# Altium schematic sheet stm32f103core.SchDoc: STM32F103C8T6最小系统
size A4; Revision: 1.0
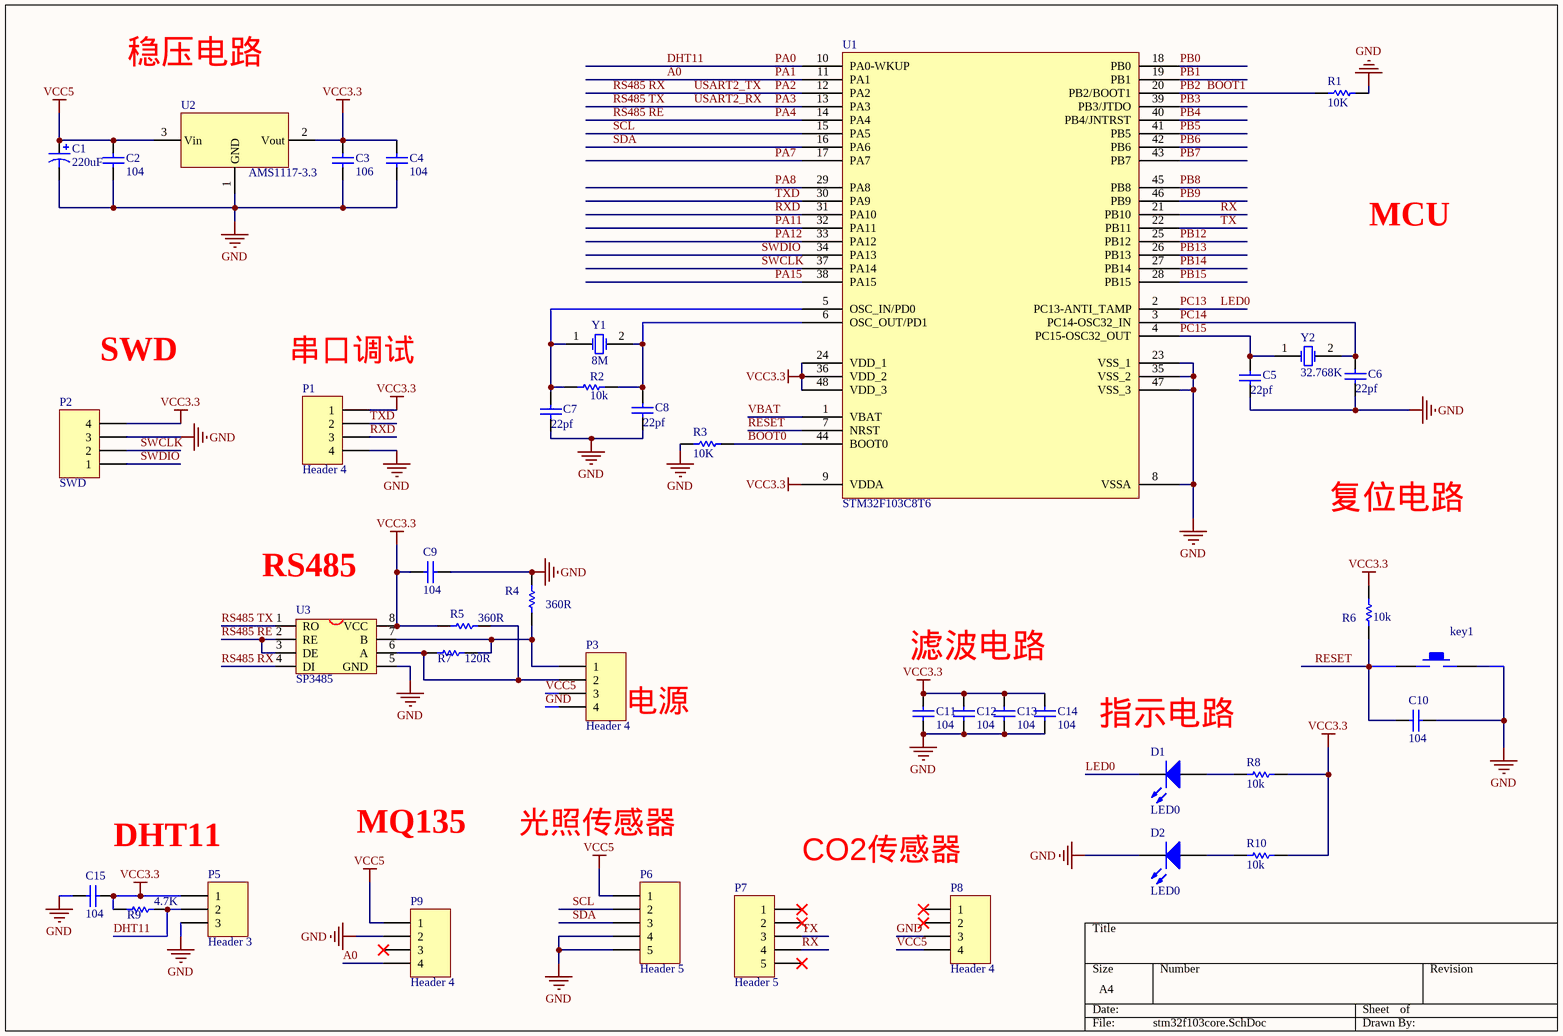
[diagram p0: stm32f103core.SchDoc]

## Parts
C1  220uF  [CC6.56.5]
C2  104  [0603p]
C3  106  [0603p]
C4  104  [0603p]
C5  22pf  [0603p]
C6  22pf  [0603p]
C7  22pf  [0603p]
C8  22pf  [0603p]
C9  104  [0603P]
C10  104  [0603p]
C11  104  [0603p]
C12  104  [0603p]
C13  104  [0603p]
C14  104  [0603p]
C15  104  [0603p]
D1  LED0  [LED0805]
D2  LED0  [LED0805]
key1  Key  [Key]  (value not drawn)
P1  Header 4  [HDR1X4]
P2  SWD  [HDR1X4]
P3  Header 4  [HDR1X4]
P5  Header 3  [HDR1X3]
P6  Header 5  [HDR1X5]
P7  Header 5  [HDR1X5]
P8  Header 4  [HDR1X4]
P9  Header 4  [HDR1X4]
R1  10K  [0603p]
R2  10k  [0603p]
R3  10K  [0603p]
R4  360R  [0603p]
R5  360R  [0603p]
R6  10k  [0603p]
R7  120R  [0603p]
R8  10k  [0603p]
R9  4.7K  [0603p]
R10  10k  [0603p]
U1  STM32F103C8T6  [LQFP48]
U2  AMS1117-3.3  [AMS1117]
U3  SP3485  [SOP-8]
Y1  8M  [49SMD]
Y2  32.768K  [XTAL32]

## Nets
GND: C1.2 C2.1 C3.1 C4.1 C5.1 C6.1 C7.1 C8.1 C9.2 C10.2 C11.1 C12.1 C13.1 C14.1 C15.1 D2.2(K) key1.2 P1.4 P2.3 P3.4 P5.3 P6.4 P6.5 P8.3 P9.2 R1.1 R3.1 R4.2 U1.8(VSSA) U1.23(VSS_1) U1.35(VSS_2) U1.47(VSS_3) U2.1(GND) U3.5(GND)
VCC3.3: C3.2 C4.2 C9.1 C11.2 C12.2 C13.2 C14.2 C15.2 P1.1 P2.4 P5.1 R5.1 R6.2 R8.2 R9.1 R10.2 U1.9(VDDA) U1.24(VDD_1) U1.36(VDD_2) U1.48(VDD_3) U2.2(Vout) U3.8(VCC)
VCC5: C1.1 C2.2 P3.3 P6.1 P8.4 P9.1 U2.3(Vin)
A0: P9.4 U1.11(PA1)  [also labelled PA1]
BOOT0: R3.2 U1.44(BOOT0)
BOOT1: R1.2 U1.20(PB2/BOOT1)  [also labelled PB2]
DHT11: P5.2 R9.2 U1.10(PA0-WKUP)  [also labelled PA0]
LED0: D1.2(K) U1.2(PC13-ANTI_TAMP)  [also labelled PC13]
PA2: U1.12(PA2) U3.4(DI)  [also labelled RS485 RX, USART2_TX]
PA3: U1.13(PA3) U3.1(RO)  [also labelled RS485 TX, USART2_RX]
PA4: U1.14(PA4) U3.2(RE) U3.3(DE)  [also labelled RS485 RE]
PA7: U1.17(PA7)
PA8: U1.29(PA8)
PA11: U1.32(PA11)
PA12: U1.33(PA12)
PA15: U1.38(PA15)
PB0: U1.18(PB0)
PB1: U1.19(PB1)
PB3: U1.39(PB3/JTDO)
PB4: U1.40(PB4/JNTRST)
PB5: U1.41(PB5)
PB6: U1.42(PB6)
PB7: U1.43(PB7)
PB8: U1.45(PB8)
PB9: U1.46(PB9)
PB12: U1.25(PB12)
PB13: U1.26(PB13)
PB14: U1.27(PB14)
PB15: U1.28(PB15)
PC14: C6.2 U1.3(PC14-OSC32_IN) Y2.2(OSC2)
PC15: C5.2 U1.4(PC15-OSC32_OUT) Y2.1(OSC1)
RESET: C10.1 key1.1 R6.1 U1.7(NRST)
RX: P7.4 U1.21(PB10)
RXD: P1.3 U1.31(PA10)
SCL: P6.2 U1.15(PA5)
SDA: P6.3 U1.16(PA6)
SWCLK: P2.2 U1.37(PA14)
SWDIO: P2.1 U1.34(PA13)
TX: P7.3 U1.22(PB11)
TXD: P1.2 U1.30(PA9)
VBAT: U1.1(VBAT)
NetC7_2: C7.2 R2.1 U1.5(OSC_IN/PD0) Y1.1(OSC1)
NetC8_2: C8.2 R2.2 U1.6(OSC_OUT/PD1) Y1.2(OSC2)
NetD1_1: D1.1(A) R8.1
NetD2_1: D2.1(A) R10.1
NetP3_1: P3.1 R4.1 R7.2 U3.7(B)
NetP3_2: P3.2 R5.2 R7.1 U3.6(A)

Not connected (* = marked no-connect by the designer): P7 1* 2* 5*; P8 1* 2*; P9 3*

## Notes on the sheet
- 稳压电路
- MCU
- SWD
- (near P1) 串口调试
- 复位电路
- (near U3) RS485
- (near P3) 电源
- 滤波电路
- 指示电路
- DHT11
- MQ135
- 光照传感器
- CO2传感器

## Library data of the parts
C1 = Cap Pol2: 极性电容; Value: 100pF; Published: 8-Jun-2000; LatestRevisionDate: 17-Jul-2002; LatestRevisionNote: Re-released for DXP Platform.; PackageReference: POLAR0.8; Publisher: Altium Limited; PackageDescription: Polarized Capacitor; 2 Leads
C2-C15 = C: Capacitor; Value: 100pF; Published: 8-Jun-2000; LatestRevisionDate: 17-Jul-2002; LatestRevisionNote: Re-released for DXP Platform.; PackageReference: RAD-0.3; Publisher: Altium Limited; PackageDescription: Radial Cap, Thru-Hole; 2 Leads; 0.3 in Pin Spacing
D1 D2 = LED0: Typical INFRARED GaAs LED; Published: 8-Jun-2000; LatestRevisionDate: 08-Jul-2005; LatestRevisionNote: Mech Layer 1 removed.; PackageReference: LED-0; Publisher: Altium Limited; PackageDescription: LED; 2 Leads
P1-P3 P8 P9 = Header 4: Header, 4-Pin; LatestRevisionDate: 17-Jul-2002; LatestRevisionNote: Re-released for DXP Platform.; Publisher: Altium Limited
P5 = Header 3: Header, 3-Pin; LatestRevisionDate: 17-Jul-2002; LatestRevisionNote: Re-released for DXP Platform.; Publisher: Altium Limited
P6 P7 = Header 5: Header, 5-Pin; LatestRevisionDate: 17-Jul-2002; LatestRevisionNote: Re-released for DXP Platform.; Publisher: Altium Limited
R1-R10 = R: Resistor; Value: 1K; Published: 8-Jun-2000; LatestRevisionDate: 17-Jul-2002; LatestRevisionNote: Re-released for DXP Platform.; PackageReference: AXIAL-0.3; Publisher: Altium Limited; PackageDescription: Axial Device, Thru-Hole; 2 Leads; 0.3 in Pin Spacing
U2 = AMS1117
U3 = MAX3485
Y1 Y2 = XTAL: Crystal Oscillator; Published: 8-Jun-2000; LatestRevisionDate: 17-Jul-2002; LatestRevisionNote: Re-released for DXP Platform.; PackageReference: R38; Publisher: Altium Limited; PackageDescription: Crystal, Thru-Hole; 2 Leads; Body 3.1 x 8.2 mm (Dia.xH)